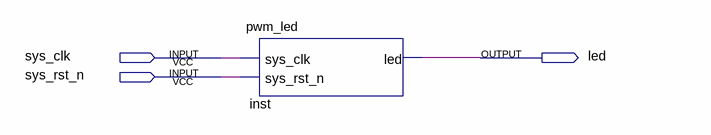
[diagram p0: schematic sheet]
// Quartus schematic pwm_led_top.bdf as structural Verilog: 1 symbols, 3 pins
module pwm_led_top (
  input  sys_clk,
  input  sys_rst_n,
  output led
);

  pwm_led inst (.sys_clk(sys_clk), .sys_rst_n(sys_rst_n), .led(led));
endmodule
